# EasyEDA schematic SCH_Tower Panda Hat_2023-01-18.json
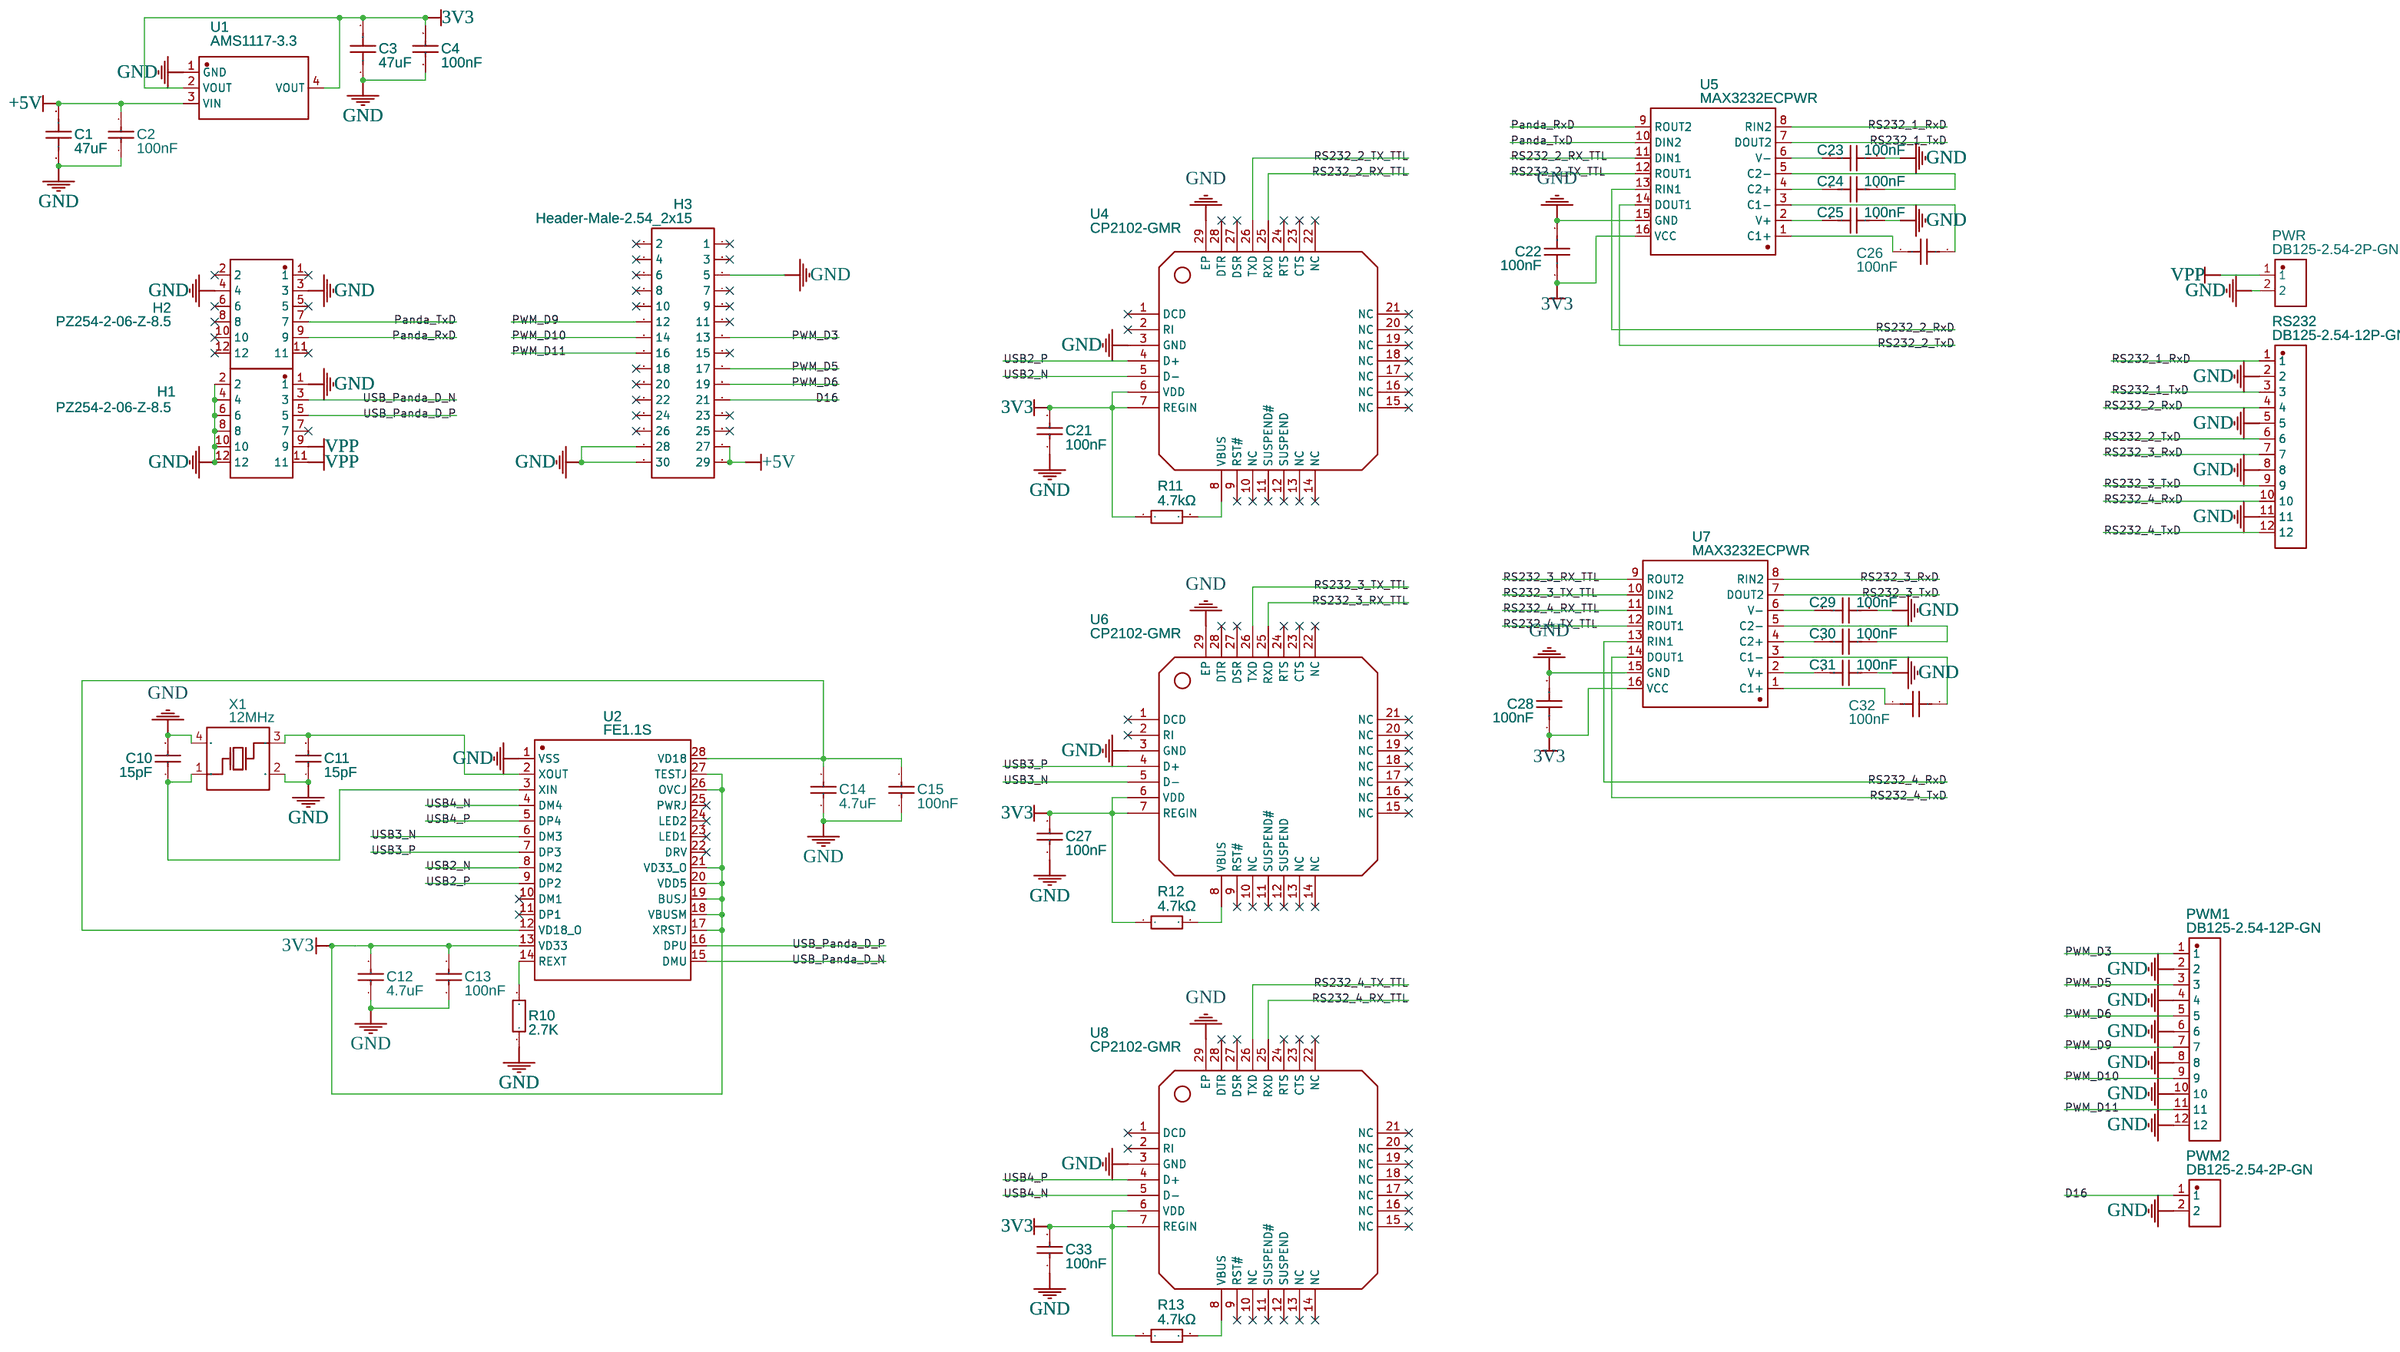
[diagram p0: schematic sheet]

## Parts
C1  47uF  [C1206]
C2  100nF  [C0402_NEW]
C3  47uF  [C1206]
C4  100nF  [C0402_NEW]
C10  15pF  [C0402]
C11  15pF  [C0402]
C12  4.7uF  [C0402]
C13  100nF  [C0402_NEW]
C14  4.7uF  [C0402]
C15  100nF  [C0402_NEW]
C21  100nF  [C0402_NEW]
C22  100nF  [C0402]
C23  100nF  [C0402]
C24  100nF  [C0402]
C25  100nF  [C0402]
C26  100nF  [C0402]
C27  100nF  [C0402_NEW]
C28  100nF  [C0402]
C29  100nF  [C0402]
C30  100nF  [C0402]
C31  100nF  [C0402]
C32  100nF  [C0402]
C33  100nF  [C0402_NEW]
H1  PZ254-2-06-Z-8.5  [HDR-TH_12P-P2.54-V-M-R2-C6-S2.54]
H2  PZ254-2-06-Z-8.5  [HDR-TH_12P-P2.54-V-M-R2-C6-S2.54]
H3  Header-Male-2.54_2x15  [HDR-TH_30P-P2.54-V-M-R2-C15-S2.54]
PWM1  DB125-2.54-12P-GN  [CONN-TH_DB125-2.54-12P-GN]
PWM2  DB125-2.54-2P-GN  [CONN-TH_DB125-2.54-2P-GN]
PWR  DB125-2.54-2P-GN  [CONN-TH_DB125-2.54-2P-GN]
R10  2.7K  [R0603]
R11  4.7kΩ  [R0402]
R12  4.7kΩ  [R0402]
R13  4.7kΩ  [R0402]
RS232  DB125-2.54-12P-GN  [CONN-TH_DB125-2.54-12P-GN]
U1  AMS1117-3.3  [SOT-223-3_L6.5-W3.4-P2.30-LS7.0-BR]
U2  FE1.1S  [SSOP-28_L9.9-W3.9-P0.64-LS6.0-BL]
U4  CP2102-GMR  [WQFN-28_L5.0-W5.0-P0.50-BL-EP3.2]
U5  MAX3232ECPWR  [TSSOP-16_L5.0-W4.4-P0.65-LS6.4-BL]
U6  CP2102-GMR  [WQFN-28_L5.0-W5.0-P0.50-BL-EP3.2]
U7  MAX3232ECPWR  [TSSOP-16_L5.0-W4.4-P0.65-LS6.4-BL]
U8  CP2102-GMR  [WQFN-28_L5.0-W5.0-P0.50-BL-EP3.2]
X1  12MHz  [OSC-SMD_4P-L3.2-W2.5-BL]

## Library data of the parts
C1 C3 = CL31A476MPHNNNE: Supplier: LCSC; Manufacturer: SAMSUNG(三星); Supplier Part: C96123; JLCPCB Part Class: Basic Part
C2 C4 C13 C15 C21 C27 C33 = CL05B104KO5NNNC: Supplier: LCSC; Manufacturer: SAMSUNG; Supplier Part: C1525; JLCPCB Part Class: Basic Part
C10 C11 = 0402CG150J500NT: Supplier: LCSC; Manufacturer: FH; Supplier Part: C1548; JLCPCB Part Class: Basic Part
C12 C14 = CL05A475MP5NRNC: Supplier: LCSC; Manufacturer: SAMSUNG; Supplier Part: C23733; JLCPCB Part Class: Basic Part
C22-C26 C28-C32 = CL05B104KB54PNC: Supplier: LCSC; Supplier Part: C307331; Manufacturer: Samsung Electro-Mechanics; Contributor: LCSC; JLCPCB Part Class: Basic Part
H1 H2 = PZ254-2-06-Z-8.5: Supplier: LCSC; Supplier Part: C2894967; Manufacturer: HCTL(华灿天禄); Contributor: LCSC; JLCPCB Part Class: Extended Part; subpart_no: 1
H3 = Header-Male-2.54_2x15: Supplier: LCSC; Manufacturer: BOOMELE(博穆精密); Manufacturer Part: 2.54-2*15P双排针; Supplier Part: C56496; JLCPCB Part Class: Extended Part
PWM1 RS232 = DB125-2.54-12P-GN: Supplier: LCSC; Supplier Part: C918129; Manufacturer: DIBO(地博电气); Manufacturer Part: DB125-2.54-12P-GN-S; Contributor: LCSC; JLCPCB Part Class: Extended Part
PWM2 PWR = DB125-2.54-2P-GN: Supplier: LCSC; Supplier Part: C918120; Manufacturer: DIBO(地博电气); Contributor: LCSC; JLCPCB Part Class: Extended Part
R10 = 0603WAF2701T5E: Supplier: LCSC; Manufacturer: UniOhm; Supplier Part: C13167; JLCPCB Part Class: Basic Part
R11-R13 = 0402WGF4701TCE: Supplier: LCSC; Manufacturer: UniOhm; Supplier Part: C25900; Resistance (Ohms): 4.7K; JLCPCB Part Class: Basic Part
U1 = AMS1117-3.3: sourceId: dwIGgezVh; Supplier: LCSC; Manufacturer: AMS; Supplier Part: C6186; JLCPCB Part Class: Basic Part
U2 = FE1.1S: Supplier: LCSC; Manufacturer: TERMINUS; Supplier Part: C9359; JLCPCB Part Class: Extended Part
U4 U6 U8 = CP2102-GMR: Supplier: LCSC; Manufacturer: SILICON LABS; Supplier Part: C6568; JLCPCB Part Class: Basic Part
U5 U7 = MAX3232ECPWR: Supplier: LCSC; Manufacturer: TI; Supplier Part: C11317; JLCPCB Part Class: Extended Part
X1 = X322512MSB4SI: Supplier: LCSC; Manufacturer: YXC; Supplier Part: C9002; Paste Type: Basic Part; JLCPCB Part Class: Basic Part

## Nets
3V3: C3.2 C4.2 C12.2 C13.2 C21.2 C22.1 C27.2 C28.1 C33.2 R11.1 R12.1 R13.1 U1.2(VOUT) U1.4(VOUT) U2.13(VD33) U2.17(XRSTJ) U2.18(VBUSM) U2.19(BUSJ) U2.20(VDD5) U2.21(VD33_O) U2.26(OVCJ) U2.27(TESTJ) U4.6(VDD) U4.7(REGIN) U5.16(VCC) U6.6(VDD) U6.7(REGIN) U7.16(VCC) U8.6(VDD) U8.7(REGIN)
+5V: C1.2 C2.2 H3.27 H3.29 U1.3(VIN)
GND: C1.1 C2.1 C3.1 C4.1 C10.2 C11.1 C12.1 C13.1 C14.1 C15.1 C21.1 C22.2 C23.2 C25.2 C27.1 C28.2 C29.2 C31.2 C33.1 H1.1 H1.2 H1.4 H1.6 H1.8 H1.10 H1.12 H2.3 H2.4 H3.5 H3.28 H3.30 PWM1.2 PWM1.4 PWM1.6 PWM1.8 PWM1.10 PWM1.12 PWM2.2 PWR.2 R10.1 RS232.2 RS232.5 RS232.8 RS232.11 U1.1(GND) U2.1(VSS) U4.3(GND) U4.29(EP) U5.15(GND) U6.3(GND) U6.29(EP) U7.15(GND) U8.3(GND) U8.29(EP) X1.2(GND) X1.4(GND)
D16: H3.21 PWM2.1
Panda_RxD: H2.9 U5.9(ROUT2)
Panda_TxD: H2.7 U5.10(DIN2)
PWM_D3: H3.13 PWM1.1
PWM_D5: H3.17 PWM1.3
PWM_D6: H3.19 PWM1.5
PWM_D9: H3.12 PWM1.7
PWM_D10: H3.14 PWM1.9
PWM_D11: H3.16 PWM1.11
RS232_1_RxD: RS232.1 U5.8(RIN2)
RS232_1_TxD: RS232.3 U5.7(DOUT2)
RS232_2_RX_TTL: U4.25(RXD) U5.11(DIN1)
RS232_2_RxD: RS232.4 U5.13(RIN1)
RS232_2_TX_TTL: U4.26(TXD) U5.12(ROUT1)
RS232_2_TxD: RS232.6 U5.14(DOUT1)
RS232_3_RX_TTL: U6.25(RXD) U7.9(ROUT2)
RS232_3_RxD: RS232.7 U7.8(RIN2)
RS232_3_TX_TTL: U6.26(TXD) U7.10(DIN2)
RS232_3_TxD: RS232.9 U7.7(DOUT2)
RS232_4_RX_TTL: U7.11(DIN1) U8.25(RXD)
RS232_4_RxD: RS232.10 U7.13(RIN1)
RS232_4_TX_TTL: U7.12(ROUT1) U8.26(TXD)
RS232_4_TxD: RS232.12 U7.14(DOUT1)
USB2_N: U2.8(DM2) U4.5(D-)
USB2_P: U2.9(DP2) U4.4(D+)
USB3_N: U2.6(DM3) U6.5(D-)
USB3_P: U2.7(DP3) U6.4(D+)
USB4_N: U2.4(DM4) U8.5(D-)
USB4_P: U2.5(DP4) U8.4(D+)
USB_Panda_D_N: H1.3 U2.15(DMU)
USB_Panda_D_P: H1.5 U2.16(DPU)
VPP: H1.9 H1.11 PWR.1
Net-(C10-1): C10.1 U2.3(XIN) X1.1(OSC1)
Net-(C11-2): C11.2 U2.2(XOUT) X1.3(OSC2)
Net-(C14-2): C14.2 C15.2 U2.12(VD18_O) U2.28(VD18)
Net-(C23-1): C23.1 U5.6(V-)
Net-(C24-1): C24.1 U5.4(C2+)
Net-(C24-2): C24.2 U5.5(C2-)
Net-(C25-1): C25.1 U5.2(V+)
Net-(C26-1): C26.1 U5.1(C1+)
Net-(C26-2): C26.2 U5.3(C1-)
Net-(C29-1): C29.1 U7.6(V-)
Net-(C30-1): C30.1 U7.4(C2+)
Net-(C30-2): C30.2 U7.5(C2-)
Net-(C31-1): C31.1 U7.2(V+)
Net-(C32-1): C32.1 U7.1(C1+)
Net-(C32-2): C32.2 U7.3(C1-)
Net-(R10-2): R10.2 U2.14(REXT)
Net-(R11-2): R11.2 U4.8(VBUS)
Net-(R12-2): R12.2 U6.8(VBUS)
Net-(R13-2): R13.2 U8.8(VBUS)

Not connected (* = marked no-connect by the designer): H1 7*; H2 1* 2* 5* 6* 8* 10* 11* 12*; H3 1* 2* 3* 4* 6* 7* 8* 9* 10* 11* 15* 18* 20* 22* 23* 24* 25* 26*; U2 10(DM1)* 11(DP1)* 22(DRV)* 23(LED1)* 24(LED2)* 25(PWRJ)*; U4 1(DCD)* 2(RI)* 9(RST#)* 10(NC)* 11(SUSPEND#)* 12(SUSPEND)* 13(NC)* 14(NC)* 15(NC)* 16(NC)* 17(NC)* 18(NC)* 19(NC)* 20(NC)* 21(NC)* 22(NC)* 23(CTS)* 24(RTS)* 27(DSR)* 28(DTR)*; U6 1(DCD)* 2(RI)* 9(RST#)* 10(NC)* 11(SUSPEND#)* 12(SUSPEND)* 13(NC)* 14(NC)* 15(NC)* 16(NC)* 17(NC)* 18(NC)* 19(NC)* 20(NC)* 21(NC)* 22(NC)* 23(CTS)* 24(RTS)* 27(DSR)* 28(DTR)*; U8 1(DCD)* 2(RI)* 9(RST#)* 10(NC)* 11(SUSPEND#)* 12(SUSPEND)* 13(NC)* 14(NC)* 15(NC)* 16(NC)* 17(NC)* 18(NC)* 19(NC)* 20(NC)* 21(NC)* 22(NC)* 23(CTS)* 24(RTS)* 27(DSR)* 28(DTR)*
